# Altium schematic sheet SCH_One.SchDoc
size A4
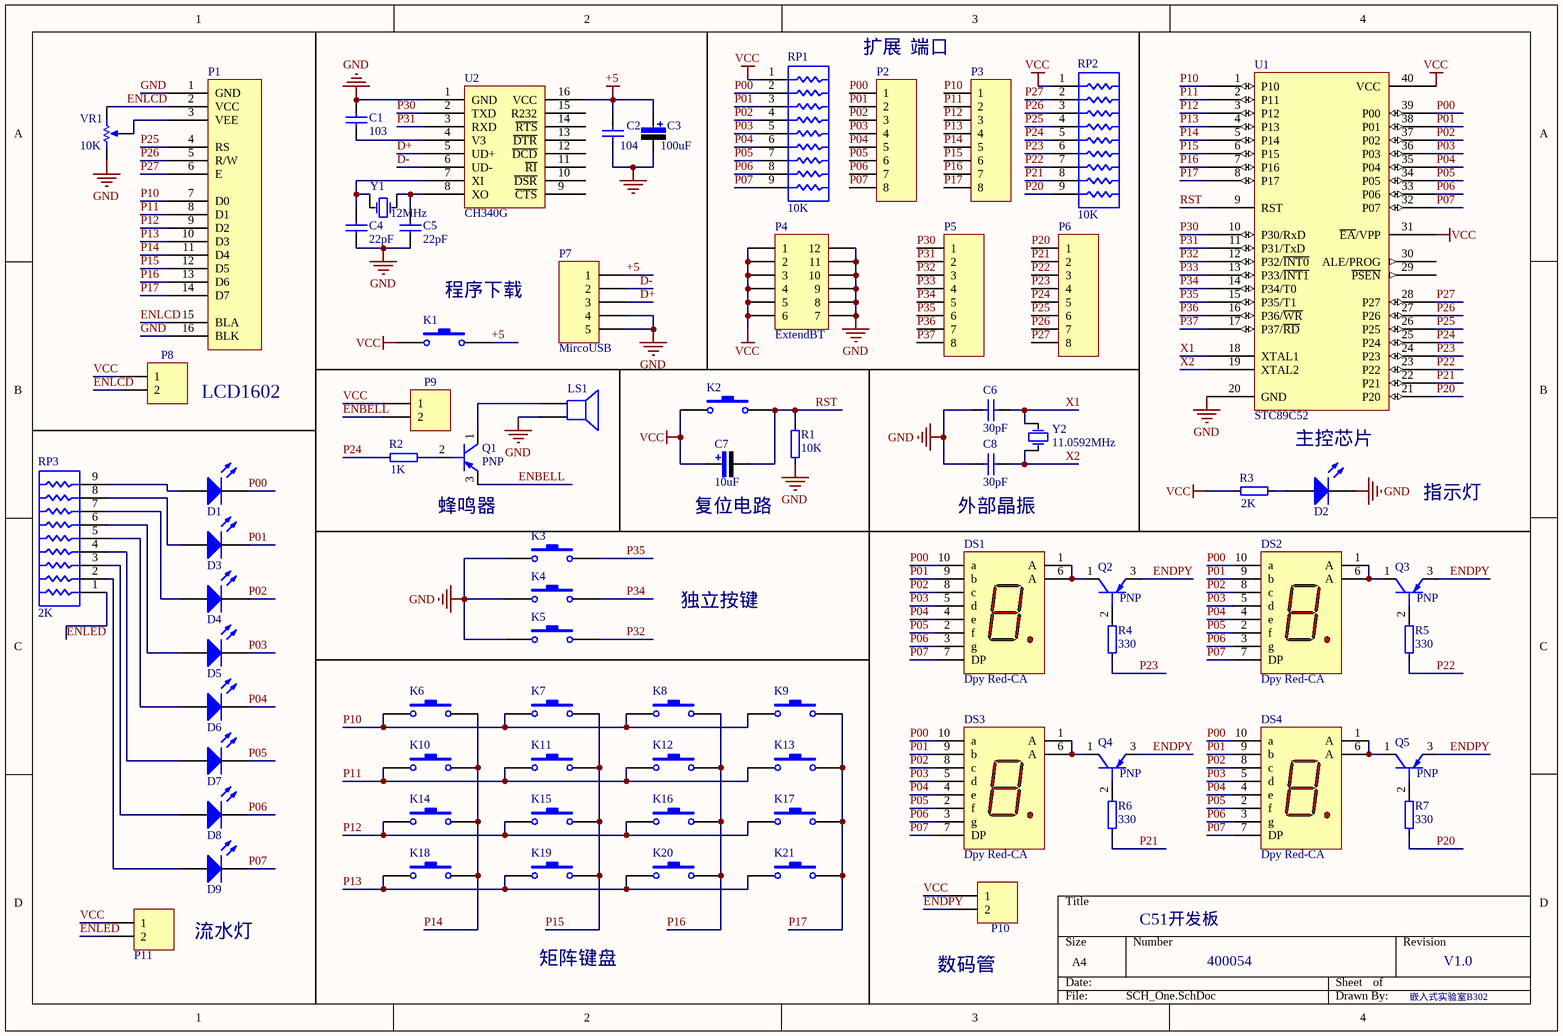
[diagram p0: SCH_One.SchDoc]

## Parts
C1  103  [C-RAD]
C2  104  [C-RAD]
C3  value 100uF  [CAP_100uF]  (hidden comment: Cap Pol)
C4  22pF  [C-RAD]
C5  22pF  [C-RAD]
C6  30pF  [C-RAD]
C7  value 10uF  [CAP_10uF]  (hidden comment: Cap Pol)
C8  30pF  [C-RAD]
D1  LED0  [LED3]  (value not drawn)
D2  LED0  [LED3]  (value not drawn)
D3  LED0  [LED3]  (value not drawn)
D4  LED0  [LED3]  (value not drawn)
D5  LED0  [LED3]  (value not drawn)
D6  LED0  [LED3]  (value not drawn)
D7  LED0  [LED3]  (value not drawn)
D8  LED0  [LED3]  (value not drawn)
D9  LED0  [LED3]  (value not drawn)
DS1  Dpy Red-CA  [A]
DS2  Dpy Red-CA  [A]
DS3  Dpy Red-CA  [A]
DS4  Dpy Red-CA  [A]
K1  Switch1  [KEY-6]  (value not drawn)
K2  Switch1  [SW_PB - 6.5x4.5]  (value not drawn)
K3  Switch1  [SW_PB - 6.5x4.5]  (value not drawn)
K4  Switch1  [SW_PB - 6.5x4.5]  (value not drawn)
K5  Switch1  [SW_PB - 6.5x4.5]  (value not drawn)
K6  Switch1  [SW_PB - 6.5x4.5]  (value not drawn)
K7  Switch1  [SW_PB - 6.5x4.5]  (value not drawn)
K8  Switch1  [SW_PB - 6.5x4.5]  (value not drawn)
K9  Switch1  [SW_PB - 6.5x4.5]  (value not drawn)
K10  Switch1  [SW_PB - 6.5x4.5]  (value not drawn)
K11  Switch1  [SW_PB - 6.5x4.5]  (value not drawn)
K12  Switch1  [SW_PB - 6.5x4.5]  (value not drawn)
K13  Switch1  [SW_PB - 6.5x4.5]  (value not drawn)
K14  Switch1  [SW_PB - 6.5x4.5]  (value not drawn)
K15  Switch1  [SW_PB - 6.5x4.5]  (value not drawn)
K16  Switch1  [SW_PB - 6.5x4.5]  (value not drawn)
K17  Switch1  [SW_PB - 6.5x4.5]  (value not drawn)
K18  Switch1  [SW_PB - 6.5x4.5]  (value not drawn)
K19  Switch1  [SW_PB - 6.5x4.5]  (value not drawn)
K20  Switch1  [SW_PB - 6.5x4.5]  (value not drawn)
K21  Switch1  [SW_PB - 6.5x4.5]  (value not drawn)
LS1  SPEAKER  [Beep]  (value not drawn)
P1  (no value)  [SIP16]
P2  Header 8  [SIP8 - duplicate]  (value not drawn)
P3  Header 8  [SIP8 - duplicate]  (value not drawn)
P4  ExtendBT  [HDR2x6]
P5  Header 8  [SIP8]  (value not drawn)
P6  Header 8  [SIP8 - duplicate]  (value not drawn)
P7  MircoUSB  [MircoUSB]
P8  Header 2  [HDR2X1_A]  (value not drawn)
P9  Header 2  [HDR2X1_A]  (value not drawn)
P10  Header 2  [HDR2X1_A]  (value not drawn)
P11  Header 2  [HDR2X1_A]  (value not drawn)
Q1  PNP  [TO-92]
Q2  PNP  [TO-92]
Q3  PNP  [TO-92]
Q4  PNP  [TO-92]
Q5  PNP  [TO-92]
R1  value 10K  [Res_DIP]  (hidden comment: Res)
R2  value 1K  [Res_DIP]  (hidden comment: Res)
R3  value 2K  [Res_DIP]  (hidden comment: Res)
R4  value 330  [Res_DIP]  (hidden comment: Res)
R5  value 330  [Res_DIP]  (hidden comment: Res)
R6  value 330  [Res_DIP]  (hidden comment: Res)
R7  value 330  [Res_DIP]  (hidden comment: Res)
RP1  10K  [SIP9 - duplicate]
RP2  10K  [SIP9 - duplicate]
RP3  2K  [SIP9 - duplicate]
U1  STC89C52  [DIP40]
U2  CH340G  [SOP-16]
VR1  10K  [VR4]
Y1  value 12MHz  [XTAL1]  (hidden comment: XTAL)
Y2  value 11.0592MHz  [XTAL1]  (hidden comment: XTAL)

## Nets
+5: C2.2 C3.1 K1.2 P7.1 U2.16(VCC)
GND: C1.2 C2.1 C3.2 C4.1 C5.1 C6.1 C8.1 D2.K K3.1 K4.1 K5.1 LS1.2 P1.1(GND) P1.16(BLK) P4.7 P4.8 P4.9 P4.10 P4.11 P4.12 P7.4 P7.5 R1.1 U1.20(GND) U2.1(GND) VR1.3(BOT)
VCC: C7.1 K1.1 K2.1 P4.1 P4.2 P4.3 P4.4 P4.5 P4.6 P8.1 P9.1 P10.1 P11.1 R3.1 RP1.1 RP2.1 U1.31(~{EA}/VPP) U1.40(VCC)
D+: P7.3 U2.5(UD+)
D-: P7.2 U2.6(UD-)
ENBELL: P9.2 Q1.3(EMITTER)
ENDPY: P10.2 Q2.3(EMITTER) Q3.3(EMITTER) Q4.3(EMITTER) Q5.3(EMITTER)
ENLCD: P1.2(VCC) P1.15(BLA) P8.2 VR1.1(TOP)
ENLED: P11.2 RP3.1
P00: D1.K DS1.10(a) DS2.10(a) DS3.10(a) DS4.10(a) P2.1 RP1.2 U1.39(P00)
P01: D3.K DS1.9(b) DS2.9(b) DS3.9(b) DS4.9(b) P2.2 RP1.3 U1.38(P01)
P02: D4.K DS1.8(c) DS2.8(c) DS3.8(c) DS4.8(c) P2.3 RP1.4 U1.37(P02)
P03: D5.K DS1.5(d) DS2.5(d) DS3.5(d) DS4.5(d) P2.4 RP1.5 U1.36(P03)
P04: D6.K DS1.4(e) DS2.4(e) DS3.4(e) DS4.4(e) P2.5 RP1.6 U1.35(P04)
P05: D7.K DS1.2(f) DS2.2(f) DS3.2(f) DS4.2(f) P2.6 RP1.7 U1.34(P05)
P06: D8.K DS1.3(g) DS2.3(g) DS3.3(g) DS4.3(g) P2.7 RP1.8 U1.33(P06)
P07: D9.K DS1.7(DP) DS2.7(DP) DS3.7(DP) DS4.7(DP) P2.8 RP1.9 U1.32(P07)
P10: K6.1 K7.1 K8.1 K9.1 P1.7(D0) P3.1 U1.1(P10)
P11: K10.1 K11.1 K12.1 K13.1 P1.8(D1) P3.2 U1.2(P11)
P12: K14.1 K15.1 K16.1 K17.1 P1.9(D2) P3.3 U1.3(P12)
P13: K18.1 K19.1 K20.1 K21.1 P1.10(D3) P3.4 U1.4(P13)
P14: K6.2 K10.2 K14.2 K18.2 P1.11(D4) P3.5 U1.5(P14)
P15: K7.2 K11.2 K15.2 K19.2 P1.12(D5) P3.6 U1.6(P15)
P16: K8.2 K12.2 K16.2 K20.2 P1.13(D6) P3.7 U1.7(P16)
P17: K9.2 K13.2 K17.2 K21.2 P1.14(D7) P3.8 U1.8(P17)
P20: P6.1 R7.1 RP2.9 U1.21(P20)
P21: P6.2 R6.1 RP2.8 U1.22(P21)
P22: P6.3 R5.1 RP2.7 U1.23(P22)
P23: P6.4 R4.1 RP2.6 U1.24(P23)
P24: P6.5 R2.1 RP2.5 U1.25(P24)
P25: P1.4(RS) P6.6 RP2.4 U1.26(P25)
P26: P1.5(R/W) P6.7 RP2.3 U1.27(P26)
P27: P1.6(E) P6.8 RP2.2 U1.28(P27)
P30: P5.1 U1.10(P30/RxD) U2.2(TXD)
P31: P5.2 U1.11(P31/TxD) U2.3(RXD)
P32: K5.2 P5.3 U1.12(P32/~{INT0})
P33: P5.4 U1.13(P33/~{INT1})
P34: K4.2 P5.5 U1.14(P34/T0)
P35: K3.2 P5.6 U1.15(P35/T1)
P36: P5.7 U1.16(P36/~{WR})
P37: P5.8 U1.17(P37/~{RD})
RST: C7.2 K2.2 R1.2 U1.9(RST)
X1: C6.2 U1.18(XTAL1) Y2.1(OSC1)
X2: C8.2 U1.19(XTAL2) Y2.2(OSC2)
NetC1_1: C1.1 U2.4(V3)
NetC4_2: C4.2 U2.7(XI) Y1.2(OSC2)
NetC5_2: C5.2 U2.8(XO) Y1.1(OSC1)
NetD1_A: D1.A RP3.9
NetD2_A: D2.A R3.2
NetD3_A: D3.A RP3.8
NetD4_A: D4.A RP3.7
NetD5_A: D5.A RP3.6
NetD6_A: D6.A RP3.5
NetD7_A: D7.A RP3.4
NetD8_A: D8.A RP3.3
NetD9_A: D9.A RP3.2
NetDS1_1: DS1.1(A) DS1.6(A) Q2.1(COLLECTOR)
NetDS2_1: DS2.1(A) DS2.6(A) Q3.1(COLLECTOR)
NetDS3_1: DS3.1(A) DS3.6(A) Q4.1(COLLECTOR)
NetDS4_1: DS4.1(A) DS4.6(A) Q5.1(COLLECTOR)
NetLS1_1: LS1.1 Q1.1(COLLECTOR)
NetP1_3: P1.3(VEE) VR1.2(TAP)
NetQ1_2: Q1.2(BASE) R2.2
NetQ2_2: Q2.2(BASE) R4.2
NetQ3_2: Q3.2(BASE) R5.2
NetQ4_2: Q4.2(BASE) R6.2
NetQ5_2: Q5.2(BASE) R7.2

Not connected (* = marked no-connect by the designer): U1 29(~{PSEN}) 30(ALE/PROG); U2 9(~{CTS}) 10(~{DSR}) 11(~{RI}) 12(~{DCD}) 13(~{DTR}) 14(~{RTS}) 15(R232)

## Notes on the sheet
- (near P2) 扩展
- 端口
- 程序下载
- LCD1602
- 主控芯片
- (near Q1) 蜂鸣器
- (near C7) 复位电路
- 外部晶振
- 指示灯
- 独立按键
- C51开发板
- 流水灯
- 矩阵键盘
- (near P10) 数码管
- 400054
- V1.0
- 嵌入式实验室B302

## Library data of the parts
C1 C2 C4-C6 C8 = Cap1: 电容; Value: *
C3 C7 = Cap Pol: 极性电解电容; Vol: 16V; Published: 8-Jun-2000; LatestRevisionDate: 17-Jul-2002; LatestRevisionNote: Re-released for DXP Platform.; PackageReference: RB7.6-15; Publisher: Altium Limited
D1-D9 = LED0: 发光二极管; Published: 8-Jun-2000; LatestRevisionDate: 08-Jul-2005; LatestRevisionNote: Mech Layer 1 removed.; PackageReference: LED-0; Publisher: Altium Limited
DS1-DS4 = Dpy Red-CA: 7.62 mm Black Surface HER 7-Segment Display: CA, RH DP; MinimumIntensity: 360 ucd; Note: IF = 5 mA; Colour: High Efficiency Red (HER); Note: Pins 1 and 6 are redundant Anodes.; Published: 8-Jun-2000; LatestRevisionDate: 17-Dec-2003; LatestRevisionNote: Schematic revised, PCB Footprint replaced.; DatasheetVersion: 19-Feb-2002; PackageVersion: 11-Feb-2002; PackageReference: A; Publisher: Altium Limited; PackageDescription: LED, 7-Segment Display, 7.62 mm, RHD; 10 Leads; Row Space 5.08 mm; Pitch 2.54 mm; ComponentLink1Description: Manufacturer Link; ComponentLink1URL: http://www.agilent.com/
K1-K21 = Switch1: 按键/单刀单掷开关
P1 = 1602: 1602液晶显示器
P2 P3 P5 P6 = Header 8: 8PIN
P4 = Header 6x2: 6PIN两排
P7 = Header 5: 5PIN
P8-P11 = Header 2: 接插件; LatestRevisionDate: 17-Jul-2002; LatestRevisionNote: Re-released for DXP Platform.; Publisher: Altium Limited
Q1-Q5 = PNP: PNP Transistor
R1-R7 = Res: 直插电阻
RP1-RP3 = Res Pack2: 9PIN排阻; Value: *
U1 = AT89C51: C51单片机; Name: *
U2 = CH340G: USB-SERIAL
VR1 = VR: 可变电阻器; Value: *
Y1 Y2 = XTAL: 晶振; Published: 8-Jun-2000; LatestRevisionDate: 17-Jul-2002; LatestRevisionNote: Re-released for DXP Platform.; PackageReference: R38; Publisher: Altium Limited